# EAGLE schematic PIC18F2550.v1b (EAGLE 5.07)
LEFT: DCIN; LICENSE: CC-0; PROJECT: PIC18F2550 BB; RIGHT: USB
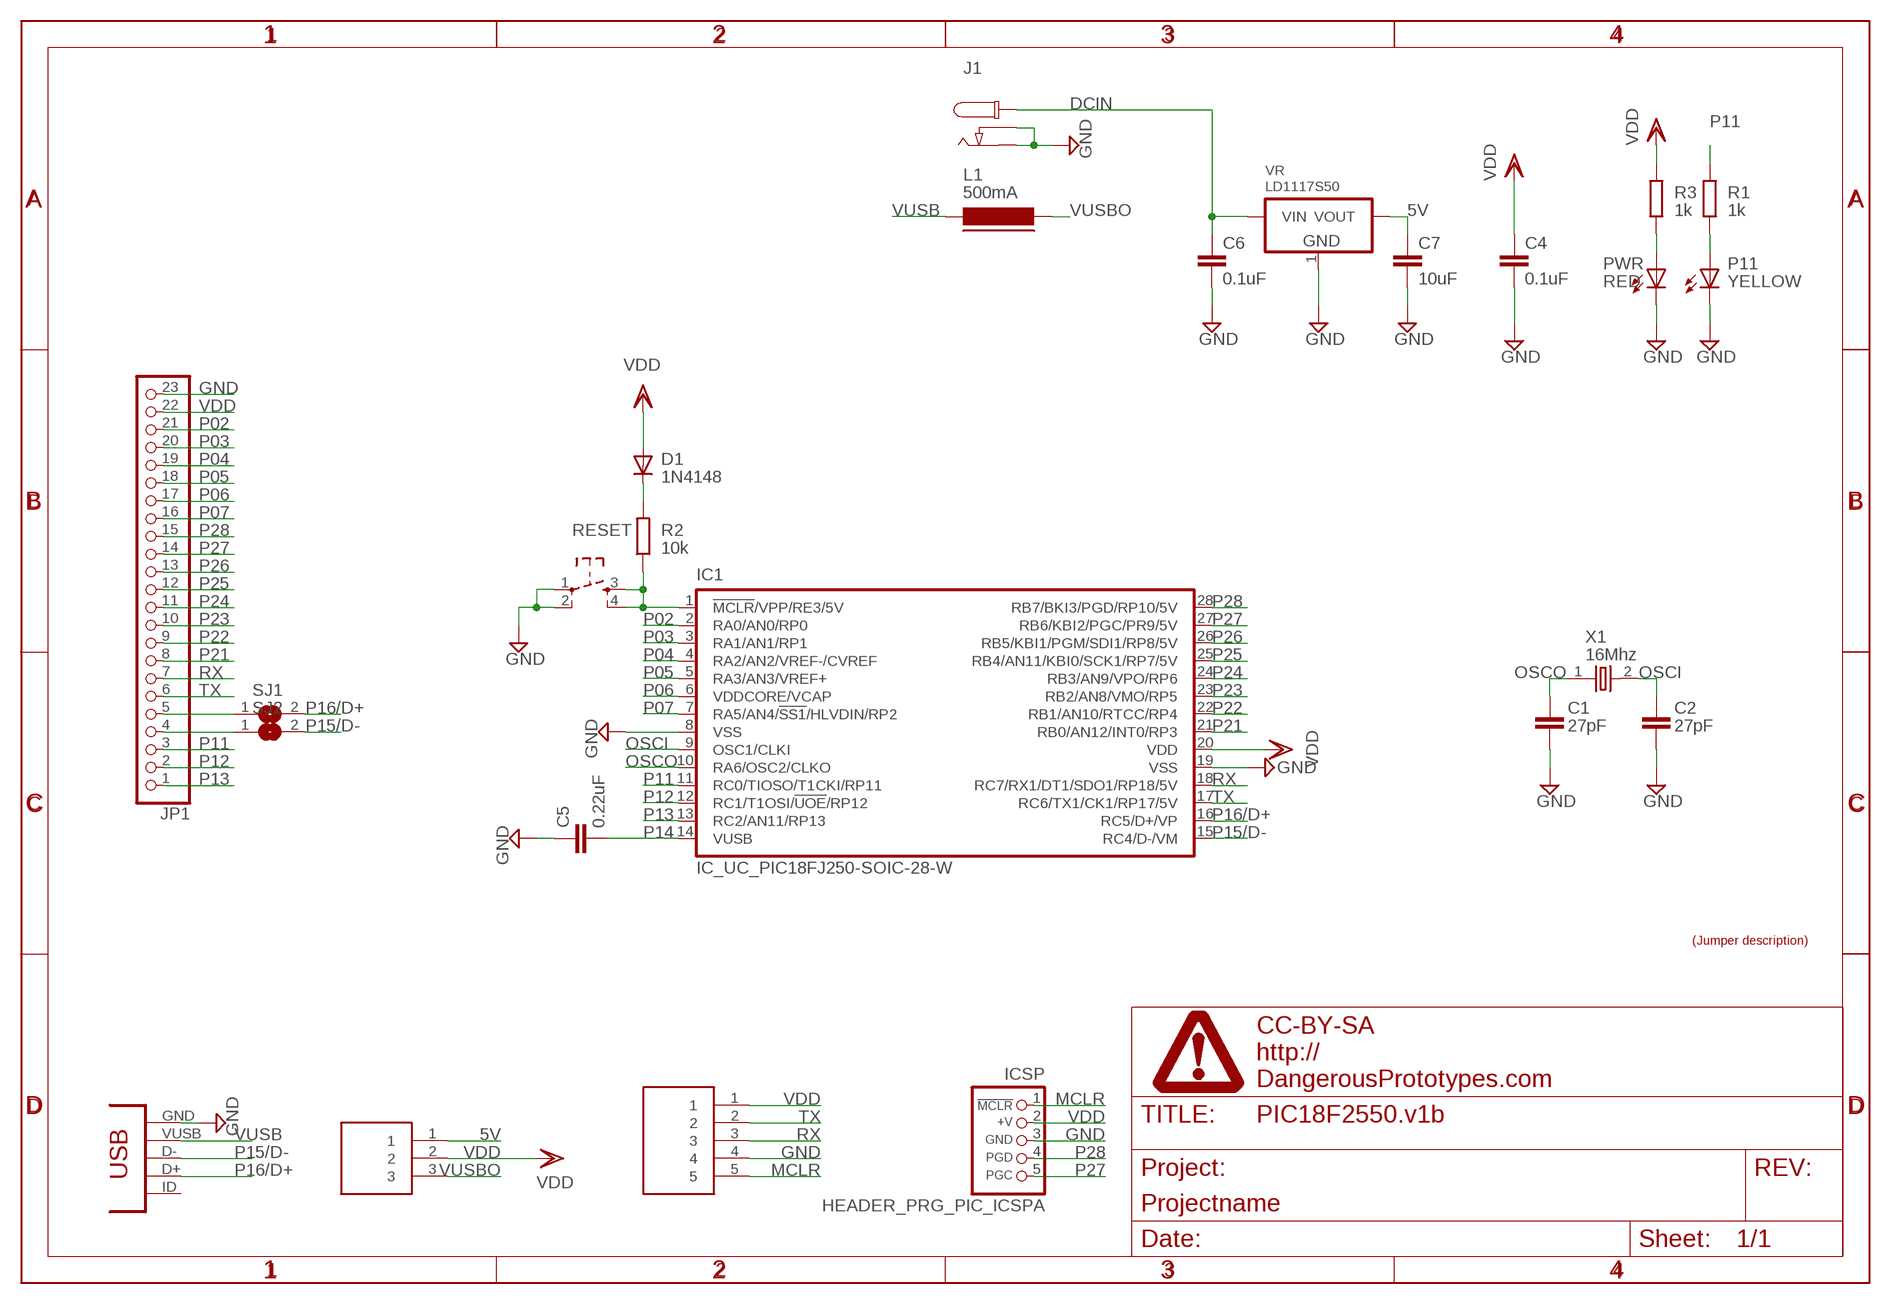
[diagram p0: schematic, sheet 1]

## Parts
C1  27pF  CAPC603  [C603]
C2  27pF  CAPC603  [C603]
C4  0.1uF  CAPC603  [C603]
C5  0.22uF  CAPC603  [C603]
C6  0.1uF  CAPC603  [C603]
C7  10uF  CAPC603  [C603]
D1  1N4148  DIODEDO323  [DO323]
IC1  IC_UC_PIC18FJ250-SOIC-28-W  [SOIC-28W]
ICSP  HEADER_PRG_PIC_ICSPA  [HEADER_PRG_1X05]
J1  DC_BARREL_JACK-SMD  [DC_BARREL_JACK_SMD_2MM]
JP1  PINHD-1X22  [1X22]
L1  500mA  FERRITE_BEAD603  [FB603]
P11  YELLOW  LED805  [LED-805]
POWER  HEADER1X3PTH  [M1X3]
PWR  RED  LED805  [LED-805]
R1  1k  RESISTORR603  [R603]
R2  10k  RESISTORR603  [R603]
R3  1k  RESISTORR603  [R603]
RESET  SW_TACT  [SW_TACT_SMALL]
SJ1  SJ  [SJ]
SJ2  SJ  [SJ]
U$1  DINA4_L  [DP_LOGO]
U$4  JUMP3_DESC  [JUMP3_DESC]
UART  HEADER1X5PTH  [M1X5]
USB  CON-USB-MINI-BUSB1  [CONN_USB_MINI-B]
VR  LD1117S50  LD1117-3.3SOT223  [SOT223]
X1  16Mhz  OSC-XTAL  [HC-49U]

## Nets
5V: C7.1 POWER.1 VR.2(VOUT)
DCIN: C6.1 J1.P1@2(P1) VR.3(VIN)
GND: C1.2 C2.2 C4.2 C5.1 C6.2 C7.2 IC1.8(VSS) IC1.19(VSS) ICSP.3(GND) J1.P2 J1.P3 JP1.23 P11.C PWR.C RESET.1 RESET.2 UART.4 USB.GND VR.1(GND)
MCLR: IC1.1(!MCLR!/VPP/RE3/5V) ICSP.1(/MCLR) R2.1 RESET.3 RESET.4 UART.5
N$1: JP1.4 SJ2.1
N$2: PWR.A R3.1
N$3: JP1.5 SJ1.1
N$4: D1.C R2.2
N$5: P11.A R1.1
OSCI: C2.1 IC1.9(OSC1/CLKI) X1.2
OSCO: C1.1 IC1.10(RA6/OSC2/CLKO) X1.1
P02: IC1.2(RA0/AN0/RP0) JP1.21
P03: IC1.3(RA1/AN1/RP1) JP1.20
P04: IC1.4(RA2/AN2/VREF-/CVREF) JP1.19
P05: IC1.5(RA3/AN3/VREF+) JP1.18
P06: IC1.6(VDDCORE/VCAP) JP1.17
P07: IC1.7(RA5/AN4/!SS1!/HLVDIN/RP2) JP1.16
P11: IC1.11(RC0/TIOSO/T1CKI/RP11) JP1.3 R1.2
P12: IC1.12(RC1/T1OSI/!UOE!/RP12) JP1.2
P13: IC1.13(RC2/AN11/RP13) JP1.1
P14: C5.2 IC1.14(VUSB)
P15/D-: IC1.15(RC4/D-/VM) SJ2.2 USB.D-
P16/D+: IC1.16(RC5/D+/VP) SJ1.2 USB.D+
P21: IC1.21(RB0/AN12/INT0/RP3) JP1.8
P22: IC1.22(RB1/AN10/RTCC/RP4) JP1.9
P23: IC1.23(RB2/AN8/VMO/RP5) JP1.10
P24: IC1.24(RB3/AN9/VPO/RP6) JP1.11
P25: IC1.25(RB4/AN11/KBI0/SCK1/RP7/5V) JP1.12
P26: IC1.26(RB5/KBI1/PGM/SDI1/RP8/5V) JP1.13
P27: IC1.27(RB6/KBI2/PGC/PR9/5V) ICSP.5(PGC) JP1.14
P28: IC1.28(RB7/BKI3/PGD/RP10/5V) ICSP.4(PGD) JP1.15
RX: IC1.18(RC7/RX1/DT1/SDO1/RP18/5V) JP1.7 UART.3
TX: IC1.17(RC6/TX1/CK1/RP17/5V) JP1.6 UART.2
VDD: C4.1 D1.A IC1.20(VDD) ICSP.2(+V) JP1.22 POWER.2 R3.2 UART.1
VUSB: L1.1 USB.VUSB
VUSBO: L1.2 POWER.3
Unconnected: USB.BODY@1(BODY) USB.BODY@2(BODY) USB.BODY@3(BODY) USB.BODY@4(BODY) USB.ID(USBID)

## Library data of the parts
C1 C2 C4-C7 = dp_devices:CAP
D1 = dp_devices:DIODE
IC1 = dp_devices:IC_UC_PIC18FJ2*50
ICSP = dp_devices:HEADER_PRG_PIC_ICSP: 5-pin PIC In Circuit Serial Programming header
J1 = dp_devices:DC_BARREL_JACK: DC power connector
JP1 = pinhead:PINHD-1X22: PIN HEADER
L1 = dp_devices:FERRITE_BEAD
P11 PWR = dp_devices:LED
POWER = dp_devices:HEADER1X3
R1-R3 = dp_devices:RESISTOR
RESET = dp_devices:SW_TACT
SJ1 SJ2 = jumper:SJ: SMD solder JUMPER
U$1 = dp_devices:DINA4_L: A4 DP frame Standard Dangerous Prototypes schematic frame. Automagically adds the DP logo and standard texts to the PCB Use the atrribute in the schematic editor to change the fields.; FF1: fulfillment by; FF2: Seeed Studio; FF3: www.seeedstudio.com; LICENSE: CC-BY-SA; PROJECT: Projectname; URL1: http://; URL2: DangerousPrototypes.com
U$4 = dp_devices:JUMP3_DESC: Nice formatted three legged jumperdescription Use attributes to change the values LEFT = With jumper to the left RIGHT = With jumper to the right; LEFT: left; RIGHT: right
UART = dp_devices:HEADER1X5
USB = dp_devices:CON-USB-MINI-B: USB connector
VR = dp_devices:LD1117-3.3
X1 = dp_devices:OSC-XTAL